# Altium schematic sheet Sheet1.SchDoc
size 381 x 241 mm
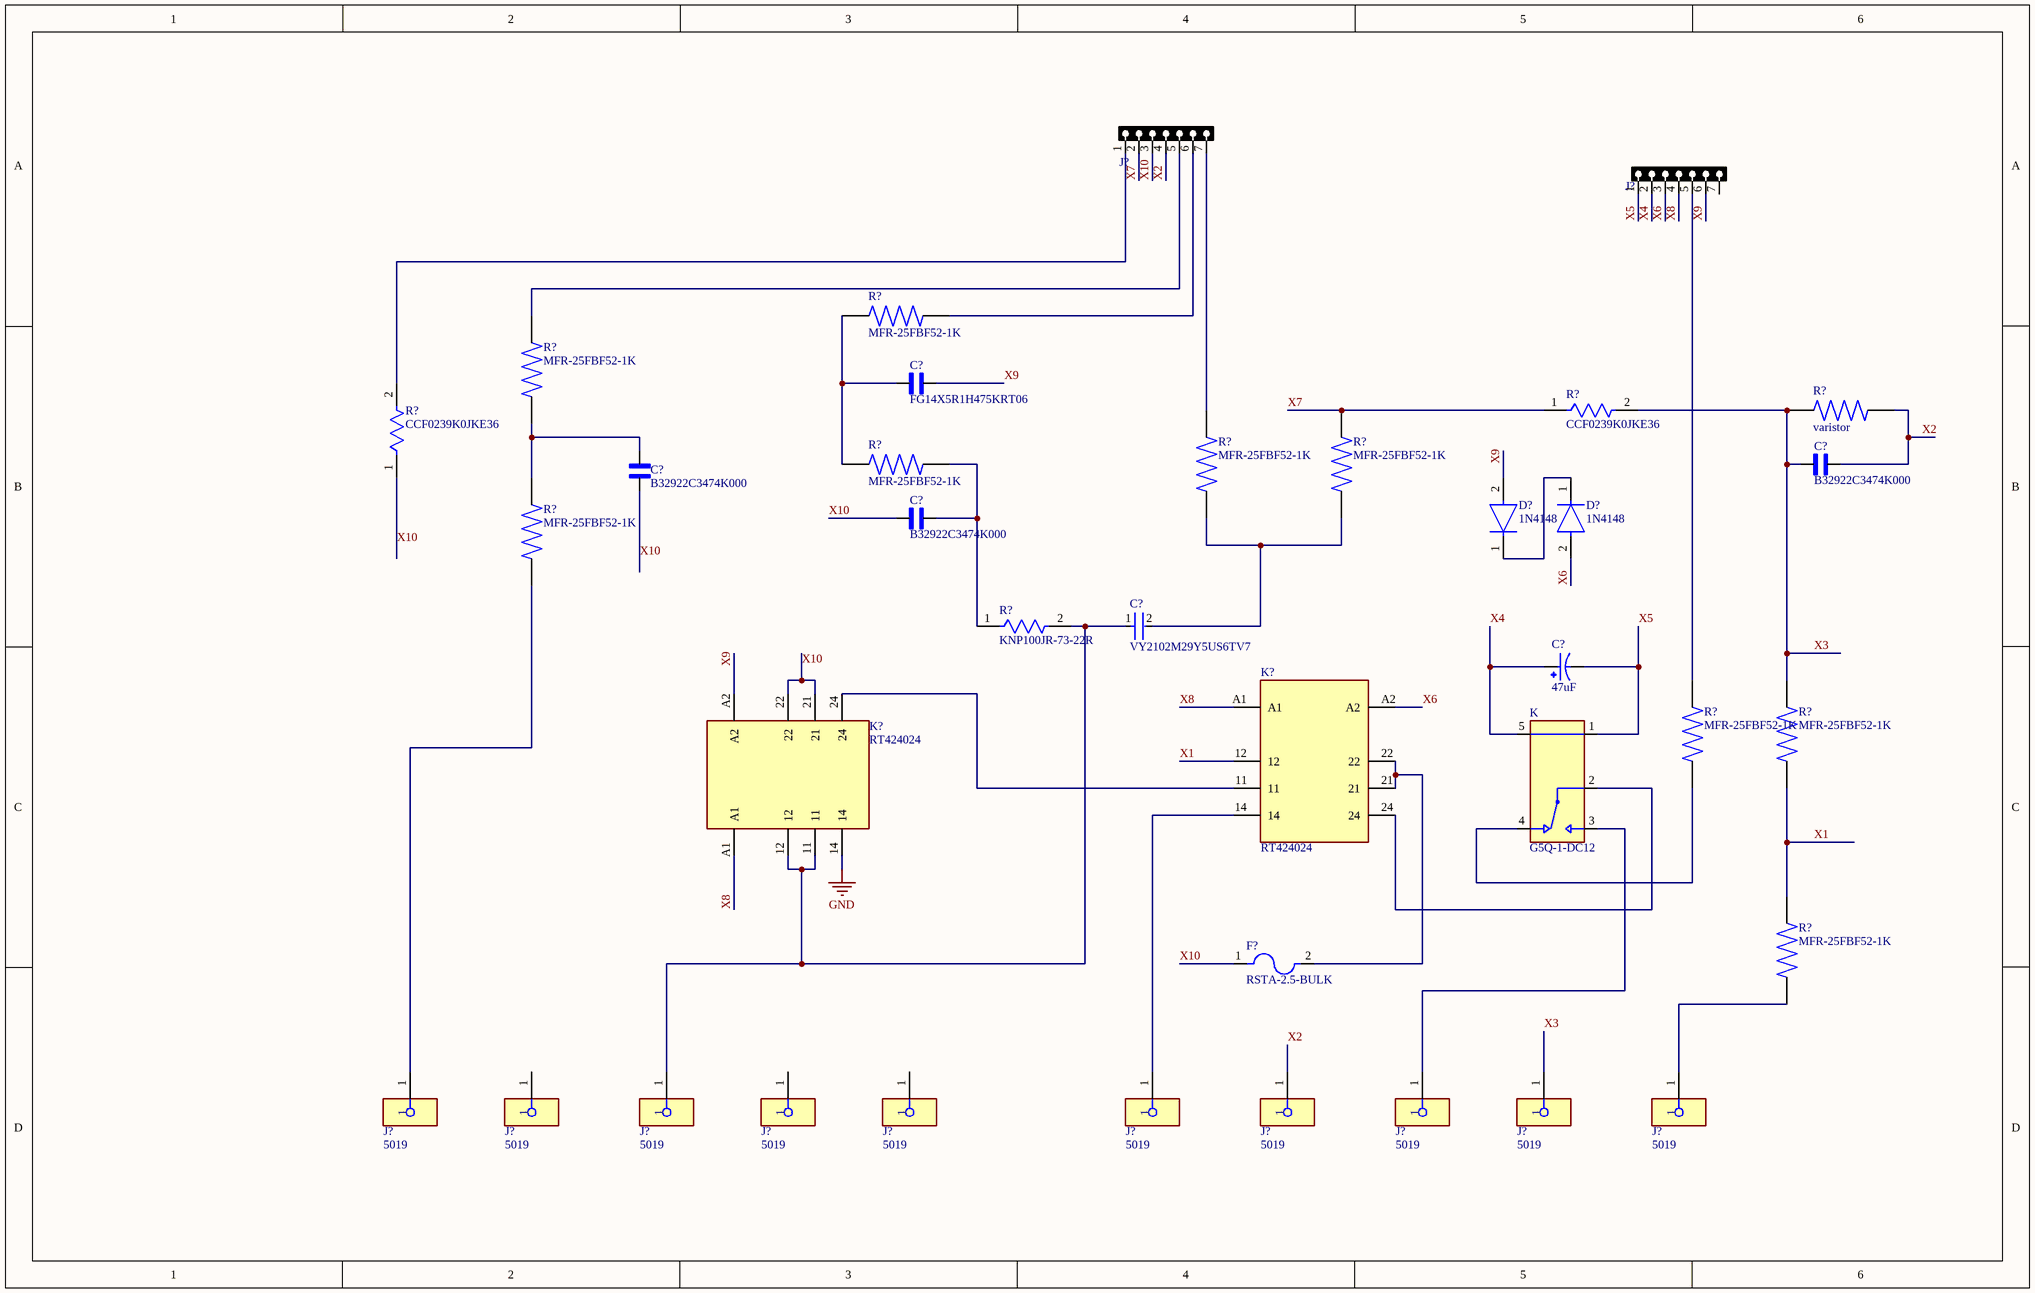
[diagram p0: Sheet1.SchDoc]

## Parts
(Parts that share a designator on the sheet are numbered #1, #2 ... from top to bottom, then left to right.)
C?#1  FG14X5R1H475KRT06  [CAPRB250W50L450T300H550]
C?#2  B32922C3474K000  [CAPRR1500W80L1800T900H1750]
C?#3  B32922C3474K000  [CAPRR1500W80L1800T900H1750]
C?#4  B32922C3474K000  [CAPRR1500W80L1800T900H1750]
C?#5  VY2102M29Y5US6TV7  [FP-VY2102M29Y5US6TV7-MFG]
C?#6  47uF  [CAPPRD500W50D630H1120]
D?#1  1N4148  [FP-017AG-MFG]
D?#2  1N4148  [FP-017AG-MFG]
F?  RSTA-2.5-BULK  [FUSE_RST-1-BULK]
J?#1  HDR1X7  [HDRMINI_F_1X7]  (value not drawn)
J?#2  HDR1X7  [HDRMINI_F_1X7]  (value not drawn)
J?#3  5019  [FP-5019-MFG]
J?#4  5019  [FP-5019-MFG]
J?#5  5019  [FP-5019-MFG]
J?#6  5019  [FP-5019-MFG]
J?#7  5019  [FP-5019-MFG]
J?#8  5019  [FP-5019-MFG]
J?#9  5019  [FP-5019-MFG]
J?#10  5019  [FP-5019-MFG]
J?#11  5019  [FP-5019-MFG]
J?#12  5019  [FP-5019-MFG]
K  G5Q-1-DC12  [RELAY_G5Q-1-DC12]
K?#1  RT424024  [RELAY_RT424024]
K?#2  RT424024  [RELAY_RT424024]
R?#1  MFR-25FBF52-1K  [RESAD1100W55L680D260]
R?#2  MFR-25FBF52-1K  [RESAD1100W55L680D260]
R?#3  CCF0239K0JKE36  [FP-CCF02-MFG]
R?#4  varistor  [RESAD1100W55L680D260]
R?#5  MFR-25FBF52-1K  [RESAD1100W55L680D260]
R?#6  MFR-25FBF52-1K  [RESAD1100W55L680D260]
R?#7  MFR-25FBF52-1K  [RESAD1100W55L680D260]
R?#8  CCF0239K0JKE36  [FP-CCF02-MFG]
R?#9  MFR-25FBF52-1K  [RESAD1100W55L680D260]
R?#10  KNP100JR-73-22R  [FP-KNP100-MFG]
R?#11  MFR-25FBF52-1K  [RESAD1100W55L680D260]
R?#12  MFR-25FBF52-1K  [RESAD1100W55L680D260]
R?#13  MFR-25FBF52-1K  [RESAD1100W55L680D260]

## Nets
GND: K?#2.14
X1: K?#1.12 R?#12.1 R?#13.2
X2: C?#2.2 J?#1.4 J?#9.1 R?#4.1
X3: C?#2.1 J?#11.1 R?#3.2 R?#4.2 R?#12.2
X4: C?#6.P J?#2.2 K.5
X5: C?#6.N J?#2.1 K.1
X6: D?#2.2(A) J?#2.3 K?#1.A2
X7: J?#1.2 R?#3.1 R?#7.2
X8: J?#2.4 K?#1.A1 K?#2.A1
X9: C?#1.2 D?#1.2(A) J?#2.6 K?#2.A2
X10: C?#3.1 C?#4.1 F?.1 J?#1.3 K?#2.21 K?#2.22 R?#8.1
NetC?#1_1: C?#1.1 R?#1.2 R?#5.2
NetC?#3_2: C?#3.2 R?#2.1 R?#9.2
NetC?#4_2: C?#4.2 R?#5.1 R?#10.1
NetC?#5_1: C?#5.1 J?#5.1 K?#2.11 K?#2.12 R?#10.2
NetC?#5_2: C?#5.2 R?#6.1 R?#7.1
NetD?#1_1: D?#1.1(C) D?#2.1(C)
NetF?_2: F?.2 K?#1.21 K?#1.22
NetJ?#1_1: J?#1.1 R?#8.2
NetJ?#1_5: J?#1.5 R?#2.2
NetJ?#1_6: J?#1.6 R?#1.1
NetJ?#1_7: J?#1.7 R?#6.2
NetJ?#2_5: J?#2.5 R?#11.2
NetJ?#3_1: J?#3.1 R?#9.1
NetJ?#8_1: J?#8.1 K?#1.14
NetJ?#10_1: J?#10.1 K.3
NetJ?#12_1: J?#12.1 R?#13.1
NetK?#1_11: K?#1.11 K?#2.24
NetK_2: K.2 K?#1.24
NetK_4: K.4 R?#11.1

Not connected (* = marked no-connect by the designer): J?#2 7; J?#4 1; J?#6 1; J?#7 1

## Library data of the parts
C?#1 = FG14X5R1H475KRT06: 4.7 ÂµF Â±10% 50V Ceramic Capacitor X5R Radial; MF: TDK; SnapEDA_Link: https://www.snapeda.com/parts/FG14X5R1H475KRT06/TDK/view-part/?ref=snap; Package: NON STANDARD-2 TDK; Value: *; MP: FG14X5R1H475KRT06; Check_prices: https://www.snapeda.com/parts/FG14X5R1H475KRT06/TDK/view-part/?ref=eda
C?#2-C?#4 = B32922C3474K000: Safety Capacitor, 0.47 uF, 305 VAC, Â± 10%, X2, Metallized PP, Radial Box - 2 Pin, Through Hole; MF: TDK; SnapEDA_Link: https://www.snapeda.com/parts/B32922C3474K000/TDK/view-part/?ref=snap; Package: None; Value: *; MP: B32922C3474K000; Check_prices: https://www.snapeda.com/parts/B32922C3474K000/TDK/view-part/?ref=eda
C?#5 = CMP-00030-42817980-1: VY2102M29Y5US6TV7 Cap Ceramic Suppression X1/Y2 0.001uF 440VAC/300VAC Y5U 20% (7.5 X 5mm) Radial 7.5mm 125C T/R; Capacitance: 1nF; Lead/Base Style: Kinked; Lead Diameter: 600µm; Voltage: 300V; Voltage Rating: 1kV; Case/Package: Radial; Height: 10.5mm; REACH SVHC: Unknown; Packaging: Tape & Reel (TR); Lead Free: Lead Free; RoHS: Compliant; Min Operating Temperature: -40°C; Max Operating Temperature: 125°C; Termination: Radial; Composition: Ceramic; Depth: 5mm; Dielectric: Y5U; Diameter: 7.5mm; Lead Pitch: 7.5mm; Schedule B: 8532230060, 8532230060; Radiation Hardening: No; Tolerance: 20%; Height - Seated (Max): 11.5062mm; Voltage Rating (AC): 300V; Material: Ceramic; Mount: Through Hole; NexarPartId: 42817980
C?#6 = ECA1JHG470B: Cap Aluminum Lytic 47uF 63V 20% (6.3 X 11.2mm) Radial 5mm 120mA 1000h 105Â°C Automotive Ammo; MF: Panasonic; Value: *; Check_prices: https://www.snapeda.com/parts/ECA1JHG470B/Panasonic/view-part/?ref=eda; MP: ECA1JHG470B; Purchase-URL: https://pricing.snapeda.com/search/part/ECA1JHG470B/?ref=eda; Price: None; Availability: In Stock; Package: RADIAL-2 Panasonic; SnapEDA_Link: https://www.snapeda.com/parts/ECA1JHG470B/Panasonic/view-part/?ref=snap
D?#1 D?#2 = CMP-07163-000046-1: DIODE GEN PURP 100V 200MA DO35; Forward Voltage: 1V; Max Power Dissipation: 500mW; Max Reverse Current: 5uA; Forward Current: 300mA; Current: 4A; Reverse Recovery Time: 4ns; Element Configuration: Single; Outside Diameter: 1.85mm; Capacitance: 4pF; Polarity: Standard; Max Forward Surge Current (Ifsm): 1A; Reverse Voltage: 100V; Output Current: 200mA; Average Rectified Current: 200mA; Diameter: 1.91mm; Max Repetitive Reverse Voltage (Vrrm): 100V; Current Rating: 200mA; Case/Package: DO-35; Lead Free: Lead Free; Number of Pins: 2; Recovery Time: 4ns; Packaging: Bulk; Contact Plating: Tin; Voltage: 100V; Mount: Through Hole; Max Surge Current: 4A; Package Quantity: 2000; Width: 1.91mm; Max Reverse Voltage (DC): 100V; Length: 4.56mm; Radiation Hardening: No; Power Dissipation: 500mW; Voltage Rating (DC): 100V; Peak Non-Repetitive Surge Current: 4A; REACH SVHC: No SVHC; Height: 4.56mm; Max Operating Temperature: 175°C; Series: -; Weight: 0.01lb; Min Operating Temperature: -65°C
F? = RSTA-2.5-BULK: 2.5 A 250 V AC 63 V DC Fuse Board Mount (Cartridge Style Excluded) Through Hole Radial, Box; MF: Bel Fuse; MP: RSTA 2.5 BULK; SnapEDA_Link: https://www.snapeda.com/parts/RSTA%202.5%20BULK/Bel+Circuit+Protection/view-part/?ref=snap; Package: Radial Box  Bel Fuse; Value: *; Check_prices: https://www.snapeda.com/parts/RSTA%202.5%20BULK/Bel+Circuit+Protection/view-part/?ref=eda
J?#1 J?#2 = HDRMINI_F_1X7: CONN, HEADER, Female, pitch: 1.27mm, 7POS; VALUE: HDRMINI_7
J?#3-J?#12 = CMP-1672-00008-2: NexarPartId: 22052288; Number of Contacts: 1; Contact Material: Bronze, Silver; Number of Pins: 1; Lead Free: Lead Free; Packaging: Tape and Reel; Mount: Surface Mount; Height: 2.286mm; Contact Plating: Silver; Material: Bronze; Termination: SMD/SMT; REACH SVHC: No SVHC; RoHS: Compliant
K = G5Q-1-DC12: General Purpose Relay SPDT _1 Form C_ 12VDC Coil Through Hole; MF: Omron Electronics; Availability: Unavailable; SnapEDA_Link: https://www.snapeda.com/parts/G5Q-1-DC12/Omron%20Electronics%20Inc-EMC%20Div/view-part/543447/?ref=snap; Price: None; Package: None; MP: G5Q-1-DC12; Value: *
K?#1 K?#2 = RT424024: General Purpose Relay DPDT (2 Form C) 24VDC Coil Through Hole; MF: TE Connectivity; Package: DIP-8 Measurement Specialties; MP: RT424024; Price: None; Availability: In Stock; Purchase-URL: https://pricing.snapeda.com/search/part/RT424024/?ref=eda; Check_prices: https://www.snapeda.com/parts/RT424024/TE+Connectivity+Potter+%2526+Brumfield+Relays/view-part/?ref=eda; Value: *; SnapEDA_Link: https://www.snapeda.com/parts/RT424024/TE+Connectivity+Potter+%2526+Brumfield+Relays/view-part/?ref=snap
R?#1 R?#2 R?#4-R?#7 R?#9 R?#11-R?#13 = MFR-25FBF52-1K: 1.07 kOhms Â±1% 0.25W, 1/4W Through Hole Resistor Axial - Metal Film; MF: Yageo; SnapEDA_Link: https://www.snapeda.com/parts/MFR-25FBF52-1K/Yageo/view-part/?ref=snap; Package: RADIAL-2 YAGEO; Value: *; MP: MFR-25FBF52-1K; Check_prices: https://www.snapeda.com/parts/MFR-25FBF52-1K/Yageo/view-part/?ref=eda
R?#3 R?#8 = CMP-02408-000002-1: Metal Film Resistors - Through Hole; Manufacturer: Vishay; Voltage Rating: 350V; Temperature Coefficient: 100ppm/°C; Tolerance: 5%; Value: 39kΩ; Power Rating: 2W; Package: CCF02; Category: Res; Ipc Land Pattern Name: RESAD1648W105L1080D406; Height: 4.06mm; Octopart: https://octopart.com/ccf0239k0jke36-vishay-98146781; Device Class L2: Resistors; Temperature Range Low: -65°C; ComponentLink2URL: https://www.vishay.com/docs/31012/ccf02.pdf; Device Class L1: Passive Components; Device Class L3: Through-Hole Resistors; Temperature: -65°C to +230°C; Lead Free: Yes; ComponentLink2Description: Datasheet; Composition: Metal Film; Manufacturer Part Number: CCF0239K0JKE36; Series: CCF02 (CCF-2); Temperature Range High: +230°C; RoHS: TRUE; Automotive: No; Resistance: 39kΩ
R?#10 = CMP-03413-000004-1: RES 22 OHM 1W 5% AXIAL; Manufacturer: Yageo; Value: 22Ω; Description: 22 Ohms ±5% 1W Through Hole Resistor Axial Flame Retardant Coating, Safety Wirewound; Temperature Coefficient: 300ppm/°C; Mouser Description: Wirewound Resistors 22ohm 1W 5%; ComponentLink2Description: Datasheet; Temperature: -40°C to +200°C; Series: KNP; Package: KNP100; Category: Res; ComponentLink2URL: https://www.yageo.com/upload/media/product/products/datasheet/lr/Yageo_LR_KNP_1.pdf; Automotive: No; RoHS: TRUE; Composition: Wirewound; Resistance: 22Ω; Device Class L1: Passive Components; Ipc Land Pattern Name: RESAD1811W100L1250D510; Digikey Description: RES 22 OHM 1W 5% AXIAL; Device Class L2: Resistors; Octopart: https://octopart.com/knp100jr-73-22r-yageo-19031610; Height: 5.1mm; Temperature Range High: +200°C; Temperature Range Low: -40°C; Manufacturer Part Number: KNP100JR-73-22R; Tolerance: 5%; Lead Free: Yes; Power Rating: 1W; Device Class L3: Through-Hole Resistors